# EasyEDA schematic 1-Schematic_copilot.json

## Sheets
1 copilot_sim: TITLE: COPILOT; REV: 1.0; Date: 2022-05-17; Sheet: 1/1; Drawn By: Nathan Scott; Company: Deakin University
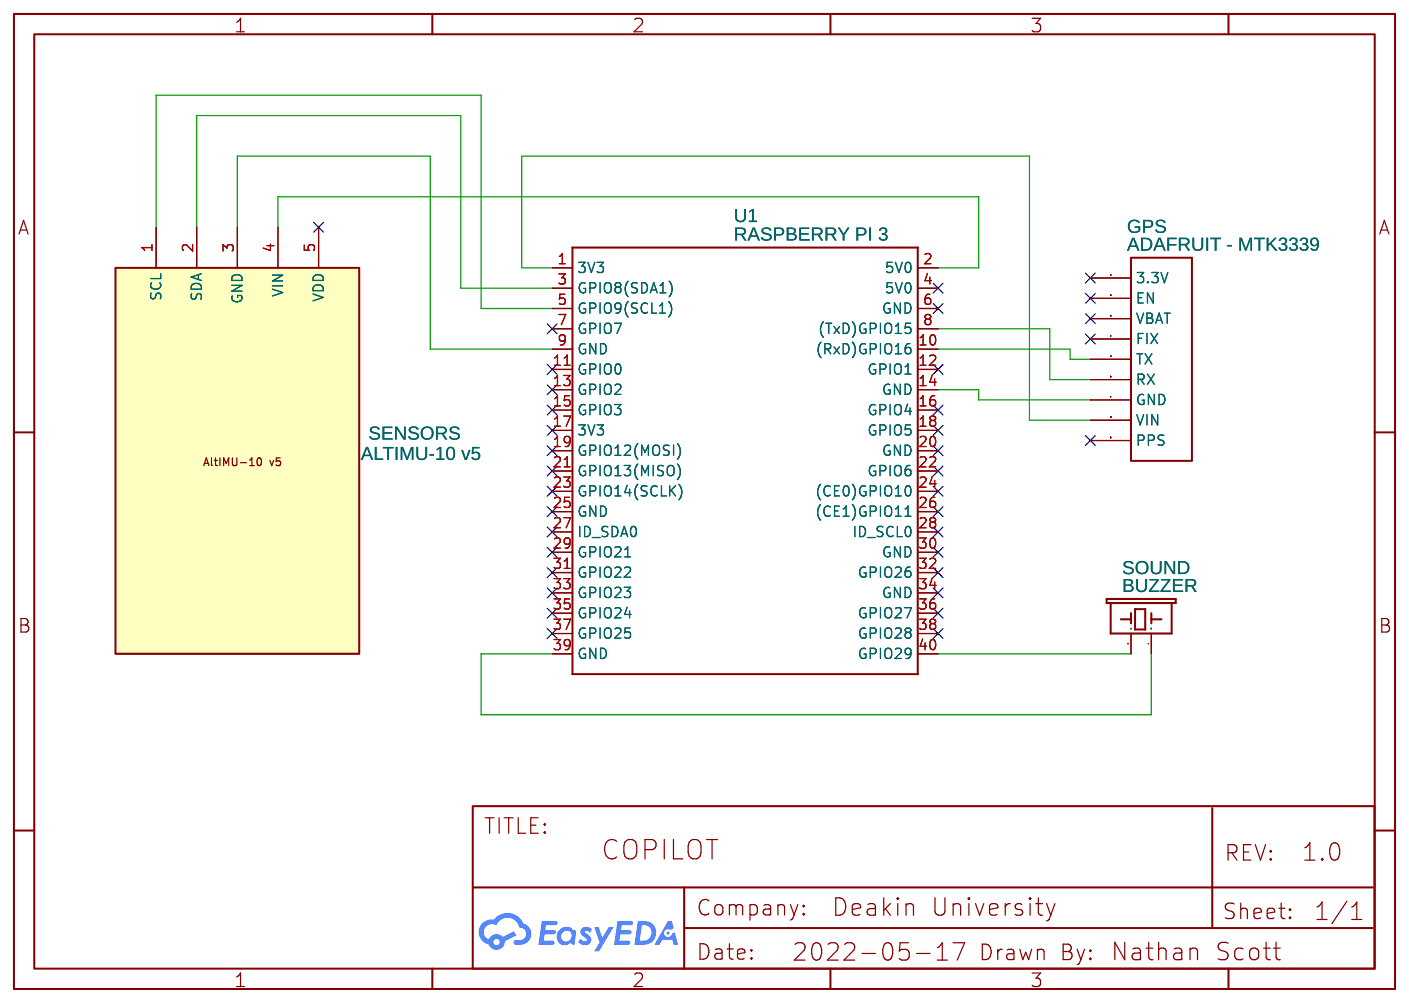
[diagram p0: copilot_sim]
2 copilot_sch
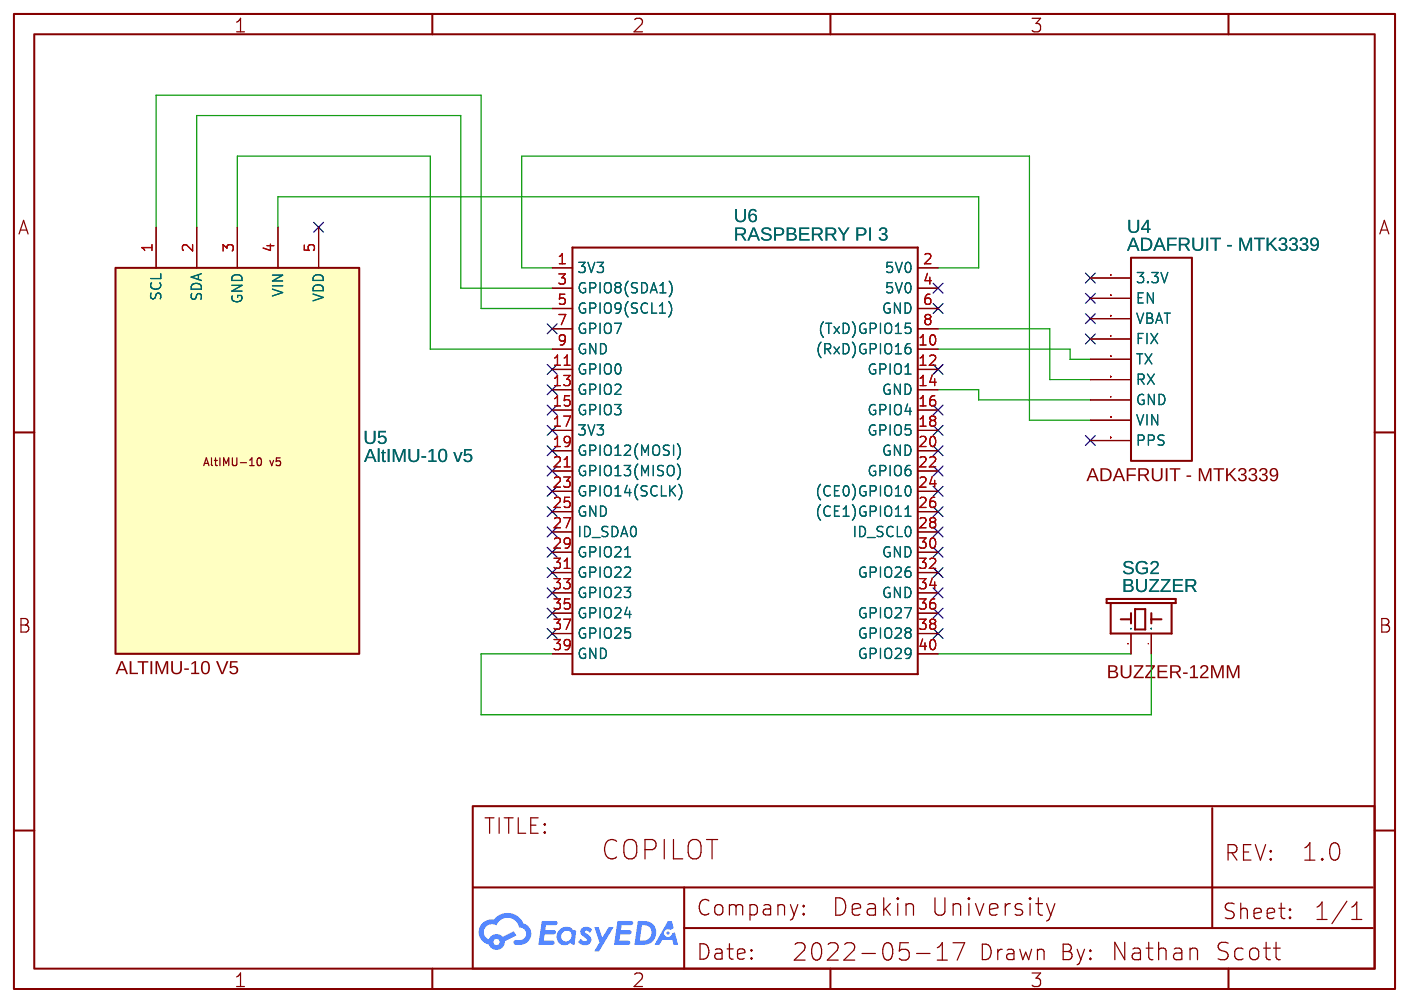
[diagram p1: copilot_sch]

## Parts
sheet copilot_sch
SG2  BUZZER  [BUZZER-12MM]
U4  ADAFRUIT - MTK3339  [ADAFRUIT - MTK3339]
U5  AltIMU-10 v5  [ALTIMU-10 V5]
U6  RASPBERRY PI 3  [RASPBERRY PI 3B]
sheet copilot_sim
GPS  ADAFRUIT - MTK3339  [ADAFRUIT - MTK3339]
SENSORS  ALTIMU-10 v5  [ALTIMU-10 V5]
SOUND  BUZZER  [BUZZER-12MM]
U1  RASPBERRY PI 3  [RASPBERRY PI 3B]

## Library data of the parts
SG2 = BUZZER: Contributor: 56sinus; Package Display: Yes
U4 = ADAFRUIT - MTK3339: Contributor: pb158; Package Display: Yes
U5 = AltIMU-10 v5: Contributor: winter2015; sourceId: YsmgyP7pj; Package Display: Yes
U1 U6 = RASPBERRY PI 3: Manufacturer: RaspberryPi.org; Supplier: RaspberryPi.org; Supplier Part: RaspberryPi 3; link: RaspberryPi.org; Contributor: RollingEnigma
GPS = ADAFRUIT - MTK3339: Contributor: pb158
SENSORS = AltIMU-10 v5: Contributor: winter2015; sourceId: YsmgyP7pj
SOUND = BUZZER: Contributor: 56sinus

## Nets
Net-(GPS-5): GPS.5(TX) U1.10((RxD)GPIO16)
Net-(GPS-6): GPS.6(RX) U1.8((TxD)GPIO15)
Net-(GPS-7): GPS.7(GND) U1.14(GND)
Net-(GPS-8): GPS.8(VIN) U1.1(3V3)
Net-(SENSORS-1): SENSORS.1(SCL) U1.5(GPIO9(SCL1))
Net-(SENSORS-2): SENSORS.2(SDA) U1.3(GPIO8(SDA1))
Net-(SENSORS-3): SENSORS.3(GND) U1.9(GND)
Net-(SENSORS-4): SENSORS.4(VIN) U1.2(5V0)
Net-(SG2-+): SG2.+(1) U6.40(GPIO29)
Net-(SG2--): SG2.-(2) U6.39(GND)
Net-(SOUND-+): SOUND.+(1) U1.40(GPIO29)
Net-(SOUND--): SOUND.-(2) U1.39(GND)
Net-(U4-5): U4.5(TX) U6.10((RxD)GPIO16)
Net-(U4-6): U4.6(RX) U6.8((TxD)GPIO15)
Net-(U4-7): U4.7(GND) U6.14(GND)
Net-(U4-8): U4.8(VIN) U6.1(3V3)
Net-(U5-1): U5.1(SCL) U6.5(GPIO9(SCL1))
Net-(U5-2): U5.2(SDA) U6.3(GPIO8(SDA1))
Net-(U5-3): U5.3(GND) U6.9(GND)
Net-(U5-4): U5.4(VIN) U6.2(5V0)

Not connected (* = marked no-connect by the designer): GPS 1(3.3V)* 2(EN)* 3(VBAT)* 4(FIX)* 9(PPS)*; SENSORS 5(VDD)*; U1 4(5V0)* 6(GND)* 7(GPIO7)* 11(GPIO0)* 12(GPIO1)* 13(GPIO2)* 15(GPIO3)* 16(GPIO4)* 17(3V3)* 18(GPIO5)* 19(GPIO12(MOSI))* 20(GND)* 21(GPIO13(MISO))* 22(GPIO6)* 23(GPIO14(SCLK))* 24((CE0)GPIO10)* 25(GND)* 26((CE1)GPIO11)* 27(ID_SDA0)* 28(ID_SCL0)* 29(GPIO21)* 30(GND)* 31(GPIO22)* 32(GPIO26)* 33(GPIO23)* 34(GND)* 35(GPIO24)* 36(GPIO27)* 37(GPIO25)* 38(GPIO28)*; U4 1(3.3V)* 2(EN)* 3(VBAT)* 4(FIX)* 9(PPS)*; U5 5(VDD)*; U6 4(5V0)* 6(GND)* 7(GPIO7)* 11(GPIO0)* 12(GPIO1)* 13(GPIO2)* 15(GPIO3)* 16(GPIO4)* 17(3V3)* 18(GPIO5)* 19(GPIO12(MOSI))* 20(GND)* 21(GPIO13(MISO))* 22(GPIO6)* 23(GPIO14(SCLK))* 24((CE0)GPIO10)* 25(GND)* 26((CE1)GPIO11)* 27(ID_SDA0)* 28(ID_SCL0)* 29(GPIO21)* 30(GND)* 31(GPIO22)* 32(GPIO26)* 33(GPIO23)* 34(GND)* 35(GPIO24)* 36(GPIO27)* 37(GPIO25)* 38(GPIO28)*
